# Altium schematic sheet Sheet1.SchDoc: Schematic
size A3; Organization: Blinkinlabs, LLC; SheetNumber: 1; SheetTotal: 1
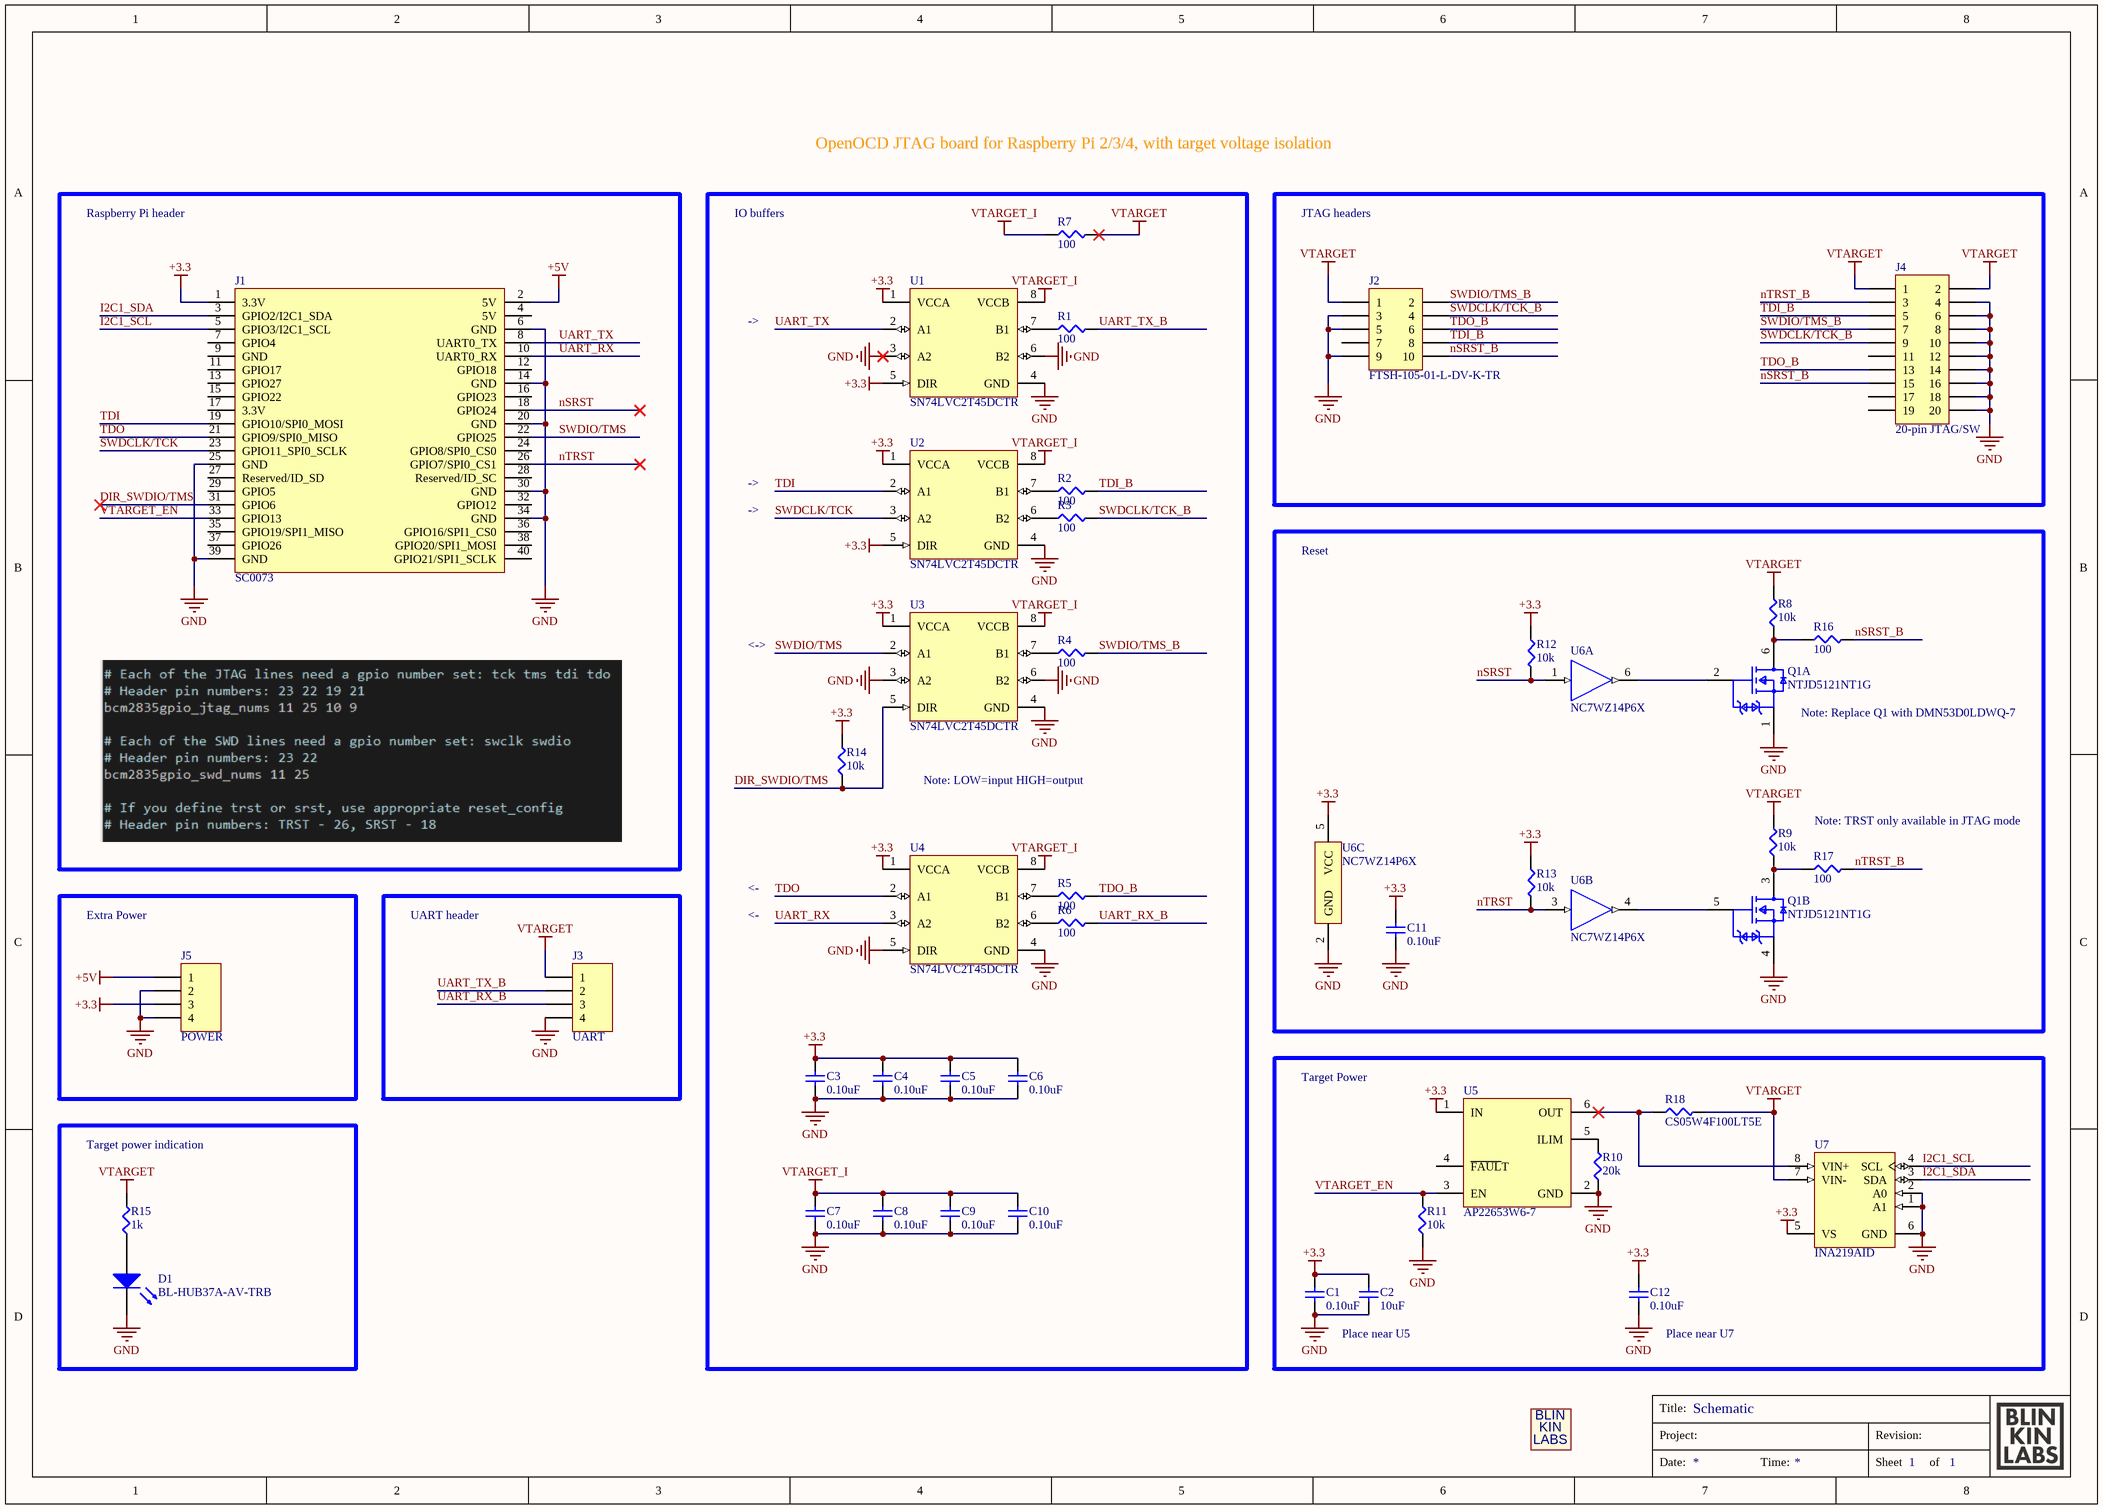
[diagram p0: Sheet1.SchDoc]

## Parts
C1  0.10uF  [CAPC1005X06L]
C2  10uF  [CAPC2012X10L]
C3  0.10uF  [CAPC1005X06L]
C4  0.10uF  [CAPC1005X06L]
C5  0.10uF  [CAPC1005X06L]
C6  0.10uF  [CAPC1005X06L]
C7  0.10uF  [CAPC1005X06L]
C8  0.10uF  [CAPC1005X06L]
C9  0.10uF  [CAPC1005X06L]
C10  0.10uF  [CAPC1005X06L]
C11  0.10uF  [CAPC1005X06L]
C12  0.10uF  [CAPC1005X06L]
D1  BL-HUB37A-AV-TRB  [BL-Hxx37A-AV-TRB]
J1  SC0073  [RaspberryPi_Connector]
J2  FTSH-105-01-L-DV-K-TR  [FTSH-105-01-L-DV-K-TR]
J3  UART  [HDR1X4]
J4  20-pin JTAG/SW  [HDR2X10]
J5  POWER  [HDR1X4]
L1  BLINKINLABS_LOGO  [BLINKINLABS_LOGO]  (value not drawn)  (no BOM)
Q1  NTJD5121NT1G  [FP-419B-02-MFG]  (parts A,B of 2)
R1  100  [ERJ2G(0402)_L]
R2  100  [ERJ2G(0402)_L]
R3  100  [ERJ2G(0402)_L]
R4  100  [ERJ2G(0402)_L]
R5  100  [ERJ2G(0402)_L]
R6  100  [ERJ2G(0402)_L]
R7  100  [ERJ2G(0402)_L]
R8  10k  [ERJ2G(0402)_L]
R9  10k  [ERJ2G(0402)_L]
R10  20k  [ERJ2G(0402)_L]
R11  10k  [ERJ2G(0402)_L]
R12  10k  [ERJ2G(0402)_L]
R13  10k  [ERJ2G(0402)_L]
R14  10k  [ERJ2G(0402)_L]
R15  1k  [ERJ2G(0402)_L]
R16  100  [ERJ2G(0402)_L]
R17  100  [ERJ2G(0402)_L]
R18  CS05W4F100LT5E  [ERJ6G(0805)_N]
U1  SN74LVC2T45DCTR  [FP-DCT0008A-MFG]
U2  SN74LVC2T45DCTR  [FP-DCT0008A-MFG]
U3  SN74LVC2T45DCTR  [FP-DCT0008A-MFG]
U4  SN74LVC2T45DCTR  [FP-DCT0008A-MFG]
U5  AP22653W6-7  [SOT95P280X145-6N-5]
U6  NC7WZ14P6X  [TSOP65P210X110-6N]  (parts A,B,C of 3)
U7  INA219AID  [D0008A_N]

## Blocks framed on the sheet
Raspberry Pi header: J1
JTAG headers: J2 J4
Extra Power: J5
UART header: J3
Target power indication: D1 R15

## Nets
+3.3: C1.2 C2.1 C3.2 C4.2 C5.2 C6.2 C11.2 C12.2 J1.1(3.3V) J5.3 R12.1 R13.1 R14.2 U1.1(VCCA) U1.5(DIR) U2.1(VCCA) U2.5(DIR) U3.1(VCCA) U4.1(VCCA) U5.1(IN) U6.5(VCC) U7.5(VS)
+5V: J1.2(5V) J5.1
GND: C1.1 C2.2 C3.1 C4.1 C5.1 C6.1 C7.1 C8.1 C9.1 C10.1 C11.1 C12.1 D1.2 J1.6(GND) J1.14(GND) J1.20(GND) J1.25(GND) J1.30(GND) J1.34(GND) J1.39(GND) J2.3 J2.5 J2.9 J3.4 J4.4 J4.6 J4.8 J4.10 J4.12 J4.14 J4.16 J4.18 J4.20 J5.2 J5.4 Q1.1(S1) Q1.4(S2) R10.1 R11.1 U1.3(A2) U1.4(GND) U1.6(B2) U2.4(GND) U3.3(A2) U3.4(GND) U3.6(B2) U4.4(GND) U4.5(DIR) U5.2(GND) U6.2(GND) U7.1(A1) U7.2(A0) U7.6(GND)
VTARGET: J2.1 J3.1 J4.1 J4.2 R7.2 R8.2 R9.2 R15.2 R18.2 U7.7(VIN-)
VTARGET_I: C7.2 C8.2 C9.2 C10.2 R7.1 U1.8(VCCB) U2.8(VCCB) U3.8(VCCB) U4.8(VCCB)
DIR_SWDIO/TMS: J1.31(GPIO6) R14.1 U3.5(DIR)
I2C1_SCL: J1.5(GPIO3/I2C1_SCL) U7.4(SCL)
I2C1_SDA: J1.3(GPIO2/I2C1_SDA) U7.3(SDA)
nSRST: J1.18(GPIO24) R12.2 U6.1(A1)
nSRST_B: J2.10 J4.15 R16.2
nTRST: J1.26(GPIO7/SPI0_CS1) R13.2 U6.3(A2)
nTRST_B: J4.3 R17.2
SWDCLK/TCK: J1.23(GPIO11_SPI0_SCLK) U2.3(A2)
SWDCLK/TCK_B: J2.4 J4.9 R3.2
SWDIO/TMS: J1.22(GPIO25) U3.2(A1)
SWDIO/TMS_B: J2.2 J4.7 R4.2
TDI: J1.19(GPIO10/SPI0_MOSI) U2.2(A1)
TDI_B: J2.8 J4.5 R2.2
TDO: J1.21(GPIO9/SPI0_MISO) U4.2(A1)
TDO_B: J2.6 J4.13 R5.2
UART_RX: J1.10(UART0_RX) U4.3(A2)
UART_RX_B: J3.3 R6.2
UART_TX: J1.8(UART0_TX) U1.2(A1)
UART_TX_B: J3.2 R1.2
VTARGET_EN: J1.33(GPIO13) R11.2 U5.3(EN)
NetD1_1: D1.1 R15.1
NetQ1_2: Q1.2(G1) U6.6(~{Y1})
NetQ1_3: Q1.3(D2) R9.1 R17.1
NetQ1_5: Q1.5(G2) U6.4(~{Y2})
NetQ1_6: Q1.6(D1) R8.1 R16.1
NetR1_1: R1.1 U1.7(B1)
NetR2_1: R2.1 U2.7(B1)
NetR3_1: R3.1 U2.6(B2)
NetR4_1: R4.1 U3.7(B1)
NetR5_1: R5.1 U4.7(B1)
NetR6_1: R6.1 U4.6(B2)
NetR10_2: R10.2 U5.5(ILIM)
NetR18_1: R18.1 U5.6(OUT) U7.8(VIN+)

Not connected (* = marked no-connect by the designer): J1 4(5V) 7(GPIO4) 9(GND) 11(GPIO17) 12(GPIO18) 13(GPIO27) 15(GPIO22) 16(GPIO23) 17(3.3V) 24(GPIO8/SPI0_CS0) 27(Reserved/ID_SD) 28(Reserved/ID_SC) 29(GPIO5) 32(GPIO12) 35(GPIO19/SPI1_MISO) 36(GPIO16/SPI1_CS0) 37(GPIO26) 38(GPIO20/SPI1_MOSI) 40(GPIO21/SPI1_SCLK); J2 7; J4 11 17 19; U5 4(~{FAUL}T)

## Notes on the sheet
- OpenOCD JTAG board for Raspberry Pi 2/3/4, with target voltage isolation
- IO buffers
- ->
- Reset
- <->
- (near Q1) Note: Replace Q1 with DMN53D0LDWQ-7
- Note: LOW=input HIGH=output
- Note: TRST only available in JTAG mode
- <-
- Target Power
- Place near U5
- (near C12) Place near U7
- Title:
- Project:
- Revision:
- Date:
- Time:
- Sheet
- of
- (in symbol BLINKINLABS_LOGO) BLIN; KIN; LABS

## Library data of the parts
C1 C3-C12 = GRM155R61C104KA88D: CAP CER 0.1UF 16V X5R 0402; Manufacturer 1: Murata Electronics North America; Tolerance: ±10%; Part Name: GRM155R61C104KA88D; Supplier 1: DigiKey; Supplier Part Number 1: 490-5415-1-ND; Manufacturer Part Number 1: GRM155R61C104KA88D; Value: 0.10uF; Voltage: 16V; Temperature Coefficient: X5R; Case/Package: 0402 (1005 Metric)
C2 = GRM21BR71A106KE51L: CAP CER 10UF 10V X7R 0805; Manufacturer 1: Murata Electronics North America; Tolerance: ±10%; Part Name: GRM21BR71A106KE51L; Supplier 1: DigiKey; Supplier Part Number 1: 490-3905-1-ND; Manufacturer Part Number 1: GRM21BR71A106KE51L; Value: 10uF; Voltage: 10V; Temperature Coefficient: X7R; Case/Package: 0805 (2012 Metric)
D1 = BL-HUB37A-AV-TRB: LED, 0402, Super Red, 50mcd@20mA, 627~637nm; Manufacturer 1: BrtLed; id: 80; Part Name: BL-HUB37A-AV-TRB; Manufacturer Part Number 1: BL-HUB37A-AV-TRB; Supplier 1: LCSC; Supplier Part Number 1: C165980; Value: BL-HUB37A-AV-TRB
J1 = SC0073: Raspberry Pi shield Header; id: 245; Part Name: SC0073; Manufacturer 1: Raspberry Pi; Manufacturer Part Number 1: SC0073; Supplier 1: DigiKey; Supplier Part Number 1: 2648-SC0073-ND; Value: SC0073
J2 = FTSH-105-01-L-DV-K-TR: 1.27mm 2 10P -55℃~+125℃ Standing paste 3.4A SMD,P=1.27mm Board-to-Board and Backplane Connector ROHS; Manufacturer 1: Samtec; id: 375; Part Name: FTSH-105-01-L-DV-K-TR; Manufacturer Part Number 1: FTSH-105-01-L-DV-K-TR; Supplier 1: LCSC; Supplier Part Number 1: C448647; Supplier 2: DigiKey; Supplier Part Number 2: SAM13165CT-ND; Value: FTSH-105-01-L-DV-K-TR
J3 J5 = Header 4: Header, 4-Pin; LatestRevisionDate: 17-Jul-2002; LatestRevisionNote: Re-released for DXP Platform.; Publisher: Altium Limited
J4 = Header 10X2: LatestRevisionDate: 17-Jul-2002; LatestRevisionNote: Re-released for DXP Platform.; Publisher: Altium Limited
L1 = BLINKINLABS_LOGO: Square logo
Q1 = NTJD5121NT1G: Mosfet Array 60V 295mA 250mW Surface Mount SC-88/SC70-6/SOT-363; Manufacturer 1: onsemi; id: 376; Part Name: NTJD5121NT1G; Manufacturer Part Number 1: NTJD5121NT1G; Supplier 1: DigiKey; Supplier Part Number 1: NTJD5121NT1GOSCT-ND; Supplier 2: LCSC; Supplier Part Number 2: C15215; Value: NTJD5121NT1G; Case/Package: 6-TSSOP, SC-88, SOT-363; Manufacturer Case/Package 1: SC-88/SC70-6/SOT-363
R1-R7 R16 R17 = ERJ-2GEJ101X: RES SMD 100 OHM 5% 1/10W 0402; Manufacturer 1: Panasonic Electronic Components; Power (Watts): 0.1W, 1/10W; Part Name: ERJ-2GEJ101X; Supplier 1: Digikey; Supplier Part Number 1: P100JCT-ND; Manufacturer Part Number 1: ERJ-2GEJ101X; Value: 100; Tolerance: ±5%; Case/Package: 0402 (1005 Metric)
R8 R9 R11-R14 = ERJ-PA2J103X: RES SMD 10K OHM 5% 1/5W 0402; Manufacturer 1: Panasonic Electronic Components; Power (Watts): 0.2W, 1/5W; Part Name: ERJ-PA2J103X; Supplier 1: Digikey; Supplier Part Number 1: P17199CT-ND; Manufacturer Part Number 1: ERJ-PA2J103X; Value: 10k; Tolerance: ±5%; Case/Package: 0402 (1005 Metric)
R10 = ERJ-2RKF2002X: RES SMD 20K OHM 1% 1/10W 0402; Manufacturer 1: Panasonic Electronic Components; Power (Watts): 0.1W, 1/10W; Part Name: ERJ-2RKF2002X; Supplier 1: Digikey; Supplier Part Number 1: P20.0KLCT-ND; Manufacturer Part Number 1: ERJ-2RKF2002X; Value: 20k; Tolerance: ±1%; Case/Package: 0402 (1005 Metric)
R15 = ERJ-2GEJ102X: RES SMD 1K OHM 5% 1/10W 0402; Manufacturer 1: Panasonic Electronic Components; Power (Watts): 0.1W, 1/10W; Part Name: ERJ-2GEJ102X; Supplier 1: Digikey; Supplier Part Number 1: P1.0KJCT-ND; Manufacturer Part Number 1: ERJ-2GEJ102X; Value: 1k; Tolerance: ±5%; Case/Package: 0402 (1005 Metric)
R18 = CS05W4F100LT5E: 250mW Thick Film Resistors 500V ±1% 100mΩ 0805 Chip Resistor - Surface Mount ROHS; Manufacturer 1: UNI-ROYAL; Manufacturer Case/Package 1: 0805; id: 379; Part Name: CS05W4F100LT5E; Manufacturer Part Number 1: CS05W4F100LT5E; Supplier 1: LCSC; Supplier Part Number 1: C474291; Value: CS05W4F100LT5E
U1-U4 = SN74LVC2T45DCTR: Voltage Level Translator Bidirectional 1 Circuit 2 Channel 420Mbps SM8; Manufacturer 1: Texas Instruments; id: 378; Part Name: SN74LVC2T45DCTR; Manufacturer Part Number 1: SN74LVC2T45DCTR; Supplier 1: DigiKey; Supplier Part Number 1: 296-16845-1-ND; Supplier 2: LCSC; Supplier Part Number 2: C22672; Value: SN74LVC2T45DCTR; Case/Package: 8-LSSOP, 8-MSOP; Manufacturer Case/Package 1: SM8
U5 = AP22653W6-7: LOAD SWITCH,SOT26,T&R,3K; Manufacturer 1: Diodes Incorporated; id: 55; Part Name: AP22653W6-7; Manufacturer Part Number 1: AP22653W6-7; Supplier 1: DigiKey; Supplier Part Number 1: 31-AP22653W6-7TR-ND; Value: AP22653W6-7; Supplier 2: LCSC; Supplier Part Number 2: C2158037
U6 = NC7WZ14P6X: Inverter IC 2 Channel Schmitt Trigger SC-88 (SC-70-6); Manufacturer 1: onsemi; id: 377; Part Name: NC7WZ14P6X; Manufacturer Part Number 1: NC7WZ14P6X; Supplier 1: DigiKey; Supplier Part Number 1: NC7WZ14P6XCT-ND; Supplier 2: LCSC; Supplier Part Number 2: C19829571; Value: NC7WZ14P6X; Case/Package: 6-TSSOP, SC-88, SOT-363; Manufacturer Case/Package 1: SC-88 (SC-70-6)
U7 = INA219AID: Current Monitor Regulator High-Side 10mA 8-SOIC; Manufacturer 1: Texas Instruments; id: 370; Part Name: INA219AID; Manufacturer Part Number 1: INA219AID; Supplier 1: DigiKey; Supplier Part Number 1: 296-33291-5-ND; Value: INA219AID; Case/Package: 8-SOIC